# Altium schematic sheet HP-server-silencer-schematic.schdoc
size 275 x 213 mm
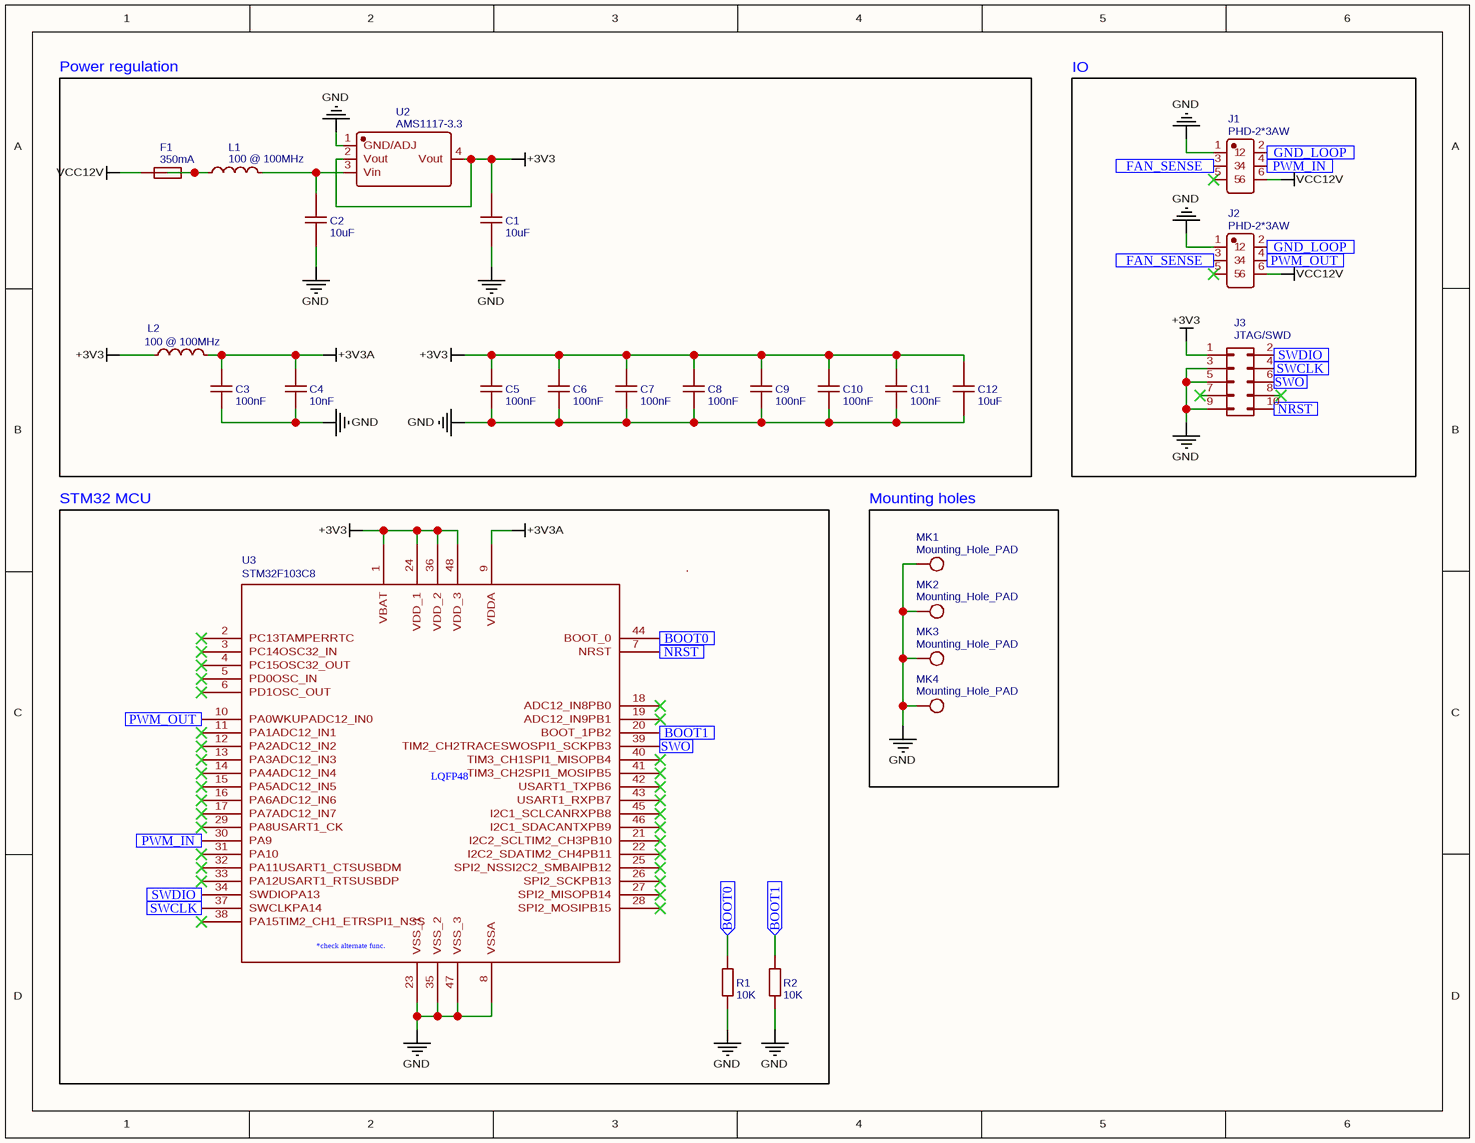
[diagram p0: HP-server-silencer-schematic.schdoc]

## Parts
C1  10uF  [C0603]
C2  10uF  [C0603]
C3  100nF  [C0402_NEW]
C4  10nF  [C0402]
C5  100nF  [C0402_NEW]
C6  100nF  [C0402_NEW]
C7  100nF  [C0402_NEW]
C8  100nF  [C0402_NEW]
C9  100nF  [C0402_NEW]
C10  100nF  [C0402_NEW]
C11  100nF  [C0402_NEW]
C12  10uF  [C0603]
F1  350mA  [F1206]
J1  PHD-2*3AW  [CONN-TH_PHD-2X3AW]
J2  PHD-2*3AW  [CONN-TH_PHD-2X3AW]
J3  JTAG/SWD  [TAG-CONNECT_TC2050-IDC-FP]
L1  100 @ 100MHz  [L0805]
L2  100 @ 100MHz  [L0805]
MK1  Mounting_Hole_PAD  [MOUNTINGHOLE_3.2MM_M3_PAD]
MK2  Mounting_Hole_PAD  [MOUNTINGHOLE_3.2MM_M3_PAD]
MK3  Mounting_Hole_PAD  [MOUNTINGHOLE_3.2MM_M3_PAD]
MK4  Mounting_Hole_PAD  [MOUNTINGHOLE_3.2MM_M3_PAD]
R1  10K  [R0603]
R2  10K  [R0603]
U2  AMS1117-3.3  [SOT-223-3_L6.5-W3.4-P2.30-LS7.0-BR]
U3  STM32F103C8  [LQFP-48_L7.0-W7.0-P0.50-LS9.0-BL]

## Blocks framed on the sheet
Power regulation: C1-C12 F1 L1 L2 U2
IO: J1-J3
STM32 MCU: R1 R2 U3
Mounting holes: MK1-MK4

## Ports
BOOT0 (in), BOOT1 (in), FAN_SENSE (in), GND_LOOP (in), NRST (in), PWM_IN (in), PWM_OUT (in), SWCLK (in), SWDIO (in), SWO (in)

## Nets
+3V3: C1.2 C5.1 C6.1 C7.1 C8.1 C9.1 C10.1 C11.1 C12.2 J3.1(P1) L2.1 U2.2(Vout) U2.4(Vout) U3.1(VBAT) U3.24(VDD_1) U3.36(VDD_2) U3.48(VDD_3)
+3V3A: C3.1 C4.1 L2.2 U3.9(VDDA)
GND: C1.1 C2.1 C3.2 C4.2 C5.2 C6.2 C7.2 C8.2 C9.2 C10.2 C11.2 C12.1 J1.1 J2.1 J3.3(P3) J3.5(P5) J3.9(P9) MK1.1 MK2.1 MK3.1 MK4.1 R1.1 R2.1 U2.1(GND/ADJ) U3.8(VSSA) U3.23(VSS_1) U3.35(VSS_2) U3.47(VSS_3)
VCC12V: F1.1 J1.6 J2.6
BOOT0: R1.2 U3.44(BOOT_0) ; port BOOT0
BOOT1: R2.2 U3.20(BOOT_1PB2) ; port BOOT1
FAN_SENSE: J1.3 J2.3 ; port FAN_SENSE
GND_LOOP: J1.2 J2.2 ; port GND_LOOP
NRST: J3.10(P10) U3.7(NRST) ; port NRST
PWM_IN: J1.4 U3.30(PA9) ; port PWM_IN
PWM_OUT: J2.4 U3.10(PA0WKUPADC12_IN0) ; port PWM_OUT
SWCLK: J3.4(P4) U3.37(SWCLKPA14) ; port SWCLK
SWDIO: J3.2(P2) U3.34(SWDIOPA13) ; port SWDIO
SWO: J3.6(P6) U3.39(TIM2_CH2TRACESWOSPI1_SCKPB3) ; port SWO
NetC2_2: C2.2 L1.2 U2.3(Vin)
NetF1_2: F1.2 L1.1

Not connected (* = marked no-connect by the designer): J1 5*; J2 5*; J3 7(P7)* 8(P8)*; U3 2(PC13TAMPERRTC)* 3(PC14OSC32_IN)* 4(PC15OSC32_OUT)* 5(PD0OSC_IN)* 6(PD1OSC_OUT)* 11(PA1ADC12_IN1)* 12(PA2ADC12_IN2)* 13(PA3ADC12_IN3)* 14(PA4ADC12_IN4)* 15(PA5ADC12_IN5)* 16(PA6ADC12_IN6)* 17(PA7ADC12_IN7)* 18(ADC12_IN8PB0)* 19(ADC12_IN9PB1)* 21(I2C2_SCLTIM2_CH3PB10)* 22(I2C2_SDATIM2_CH4PB11)* 25(SPI2_NSSI2C2_SMBAlPB12)* 26(SPI2_SCKPB13)* 27(SPI2_MISOPB14)* 28(SPI2_MOSIPB15)* 29(PA8USART1_CK)* 31(PA10)* 32(PA11USART1_CTSUSBDM)* 33(PA12USART1_RTSUSBDP)* 38(PA15TIM2_CH1_ETRSPI1_NSS)* 40(TIM3_CH1SPI1_MISOPB4)* 41(TIM3_CH2SPI1_MOSIPB5)* 42(USART1_TXPB6)* 43(USART1_RXPB7)* 45(I2C1_SCLCANRXPB8)* 46(I2C1_SDACANTXPB9)*

## Notes on the sheet
- (in symbol STM32F103C8) LQFP48; *check alternate func.

## Library data of the parts
C1 C2 C12 = 10uF: BOM_Manufacturer: SAMSUNG; BOM_Manufacturer Part: CL10A106KP8NNNC; nameAlias: Capacitance; BOM_Supplier: LCSC; BOM_Supplier Part: C19702; BOM_JLCPCB Part Class: Basic Part; spicePre: C; spiceSymbolName: CL10A106KP8NNNC
C3 C5-C11 = 100nF: BOM_Manufacturer Part: CL05B104KO5NNNC; BOM_Manufacturer: SAMSUNG; nameAlias: Capacitance; BOM_Supplier: LCSC; BOM_Supplier Part: C1525; BOM_JLCPCB Part Class: Basic Part; spicePre: C; spiceSymbolName: CL05B104KO5NNNC
C4 = 10nF: BOM_Manufacturer Part: CL05B103KB5NNNC; BOM_Manufacturer: SAMSUNG; nameAlias: Capacitance; BOM_Supplier: LCSC; BOM_Supplier Part: C15195; BOM_JLCPCB Part Class: Basic Part; spicePre: C; spiceSymbolName: CL05B103KB5NNNC
F1 = 350mA: BOM_Manufacturer: Littelfuse; BOM_Manufacturer Part: 1206L035YR; BOM_Paste Type: Extended Part; BOM_Supplier: LCSC; BOM_Supplier Part: C99562; BOM_JLCPCB Part Class: Extended Part; spicePre: U; spiceSymbolName: 1206L035YR
J1 J2 = PHD-2*3AW: BOM_Manufacturer: FG(富港); Contributor: LCSC; BOM_Supplier: LCSC; BOM_Supplier Part: C2829818; BOM_Manufacturer Part: PHD-2*3AW; spicePre: C; spiceSymbolName: PHD-2*3AW
J3 = JTAG/SWD: Contributor: KiCAD; license: https://www.gnu.org/licenses/lgpl-2.1.html; spicePre: J; spiceSymbolName: CONN_02X05
L1 L2 = 100 @ 100MHz: BOM_Manufacturer: FH; BOM_Manufacturer Part: CBW201209U101T; nameAlias: Value(H); Value: 100Ω; BOM_Supplier: LCSC; BOM_Supplier Part: C74487; BOM_JLCPCB Part Class: Extended Part; spicePre: L; spiceSymbolName: CBW201209U101T
MK1 = Mounting_Hole_PAD: Contributor: KiCAD; Package Display: No; license: https://www.gnu.org/licenses/lgpl-2.1.html; spicePre: M; spiceSymbolName: Mounting_Hole_PAD
MK2-MK4 = Mounting_Hole_PAD: Contributor: KiCAD; license: https://www.gnu.org/licenses/lgpl-2.1.html; spicePre: M; spiceSymbolName: Mounting_Hole_PAD
R1 R2 = 10K: BOM_Manufacturer: UniOhm; BOM_Manufacturer Part: 0603WAF1002T5E; nameAlias: Resistance (Ohms); BOM_Supplier: LCSC; BOM_Supplier Part: C25804; BOM_JLCPCB Part Class: Basic Part; spicePre: R; spiceSymbolName: 0603WAF1002T5E
U2 = AMS1117-3.3: BOM_Manufacturer: AMS; sourceId: dwIGgezVh; timeStamp: 1476261164; BOM_Supplier: LCSC; BOM_Manufacturer Part: AMS1117-3.3; BOM_Supplier Part: C6186; BOM_JLCPCB Part Class: Basic Part; spicePre: U; spiceSymbolName: AMS1117-3.3
U3 = STM32F103C8: BOM_Manufacturer Part: STM32F103C8T6; BOM_Manufacturer: STMicroelectronics; spicePre: U; spiceSymbolName: STM32F103C8; BOM_Supplier: LCSC; BOM_Supplier Part: C8734; JLCPCB Part Class: Basic Part